# Altium schematic sheet DCDC_Slow.SchDoc
size 594 x 420 mm; Address1: Address1; Address2: Address2; Address3: Address3; Address4: Address4; SheetNumber: 1; Scale: 1:1; Разраб.: Иванов; Обозначение документа: АБВГ.123456.001 Э3; Пров.: Петров; Утв.: Сидоров; Наименование организации: ОАО "Концерн "МПО-Гидроприбор"; Перв. применение: АБВГ.123456.000; Наименование изделия 1: Плата; Наименование изделия 2: Схема электрическая; Наименование изделия 3: принципиальная; Нач. отд.: Нач. отд.; Фамилия нач. отд.: Сидоров
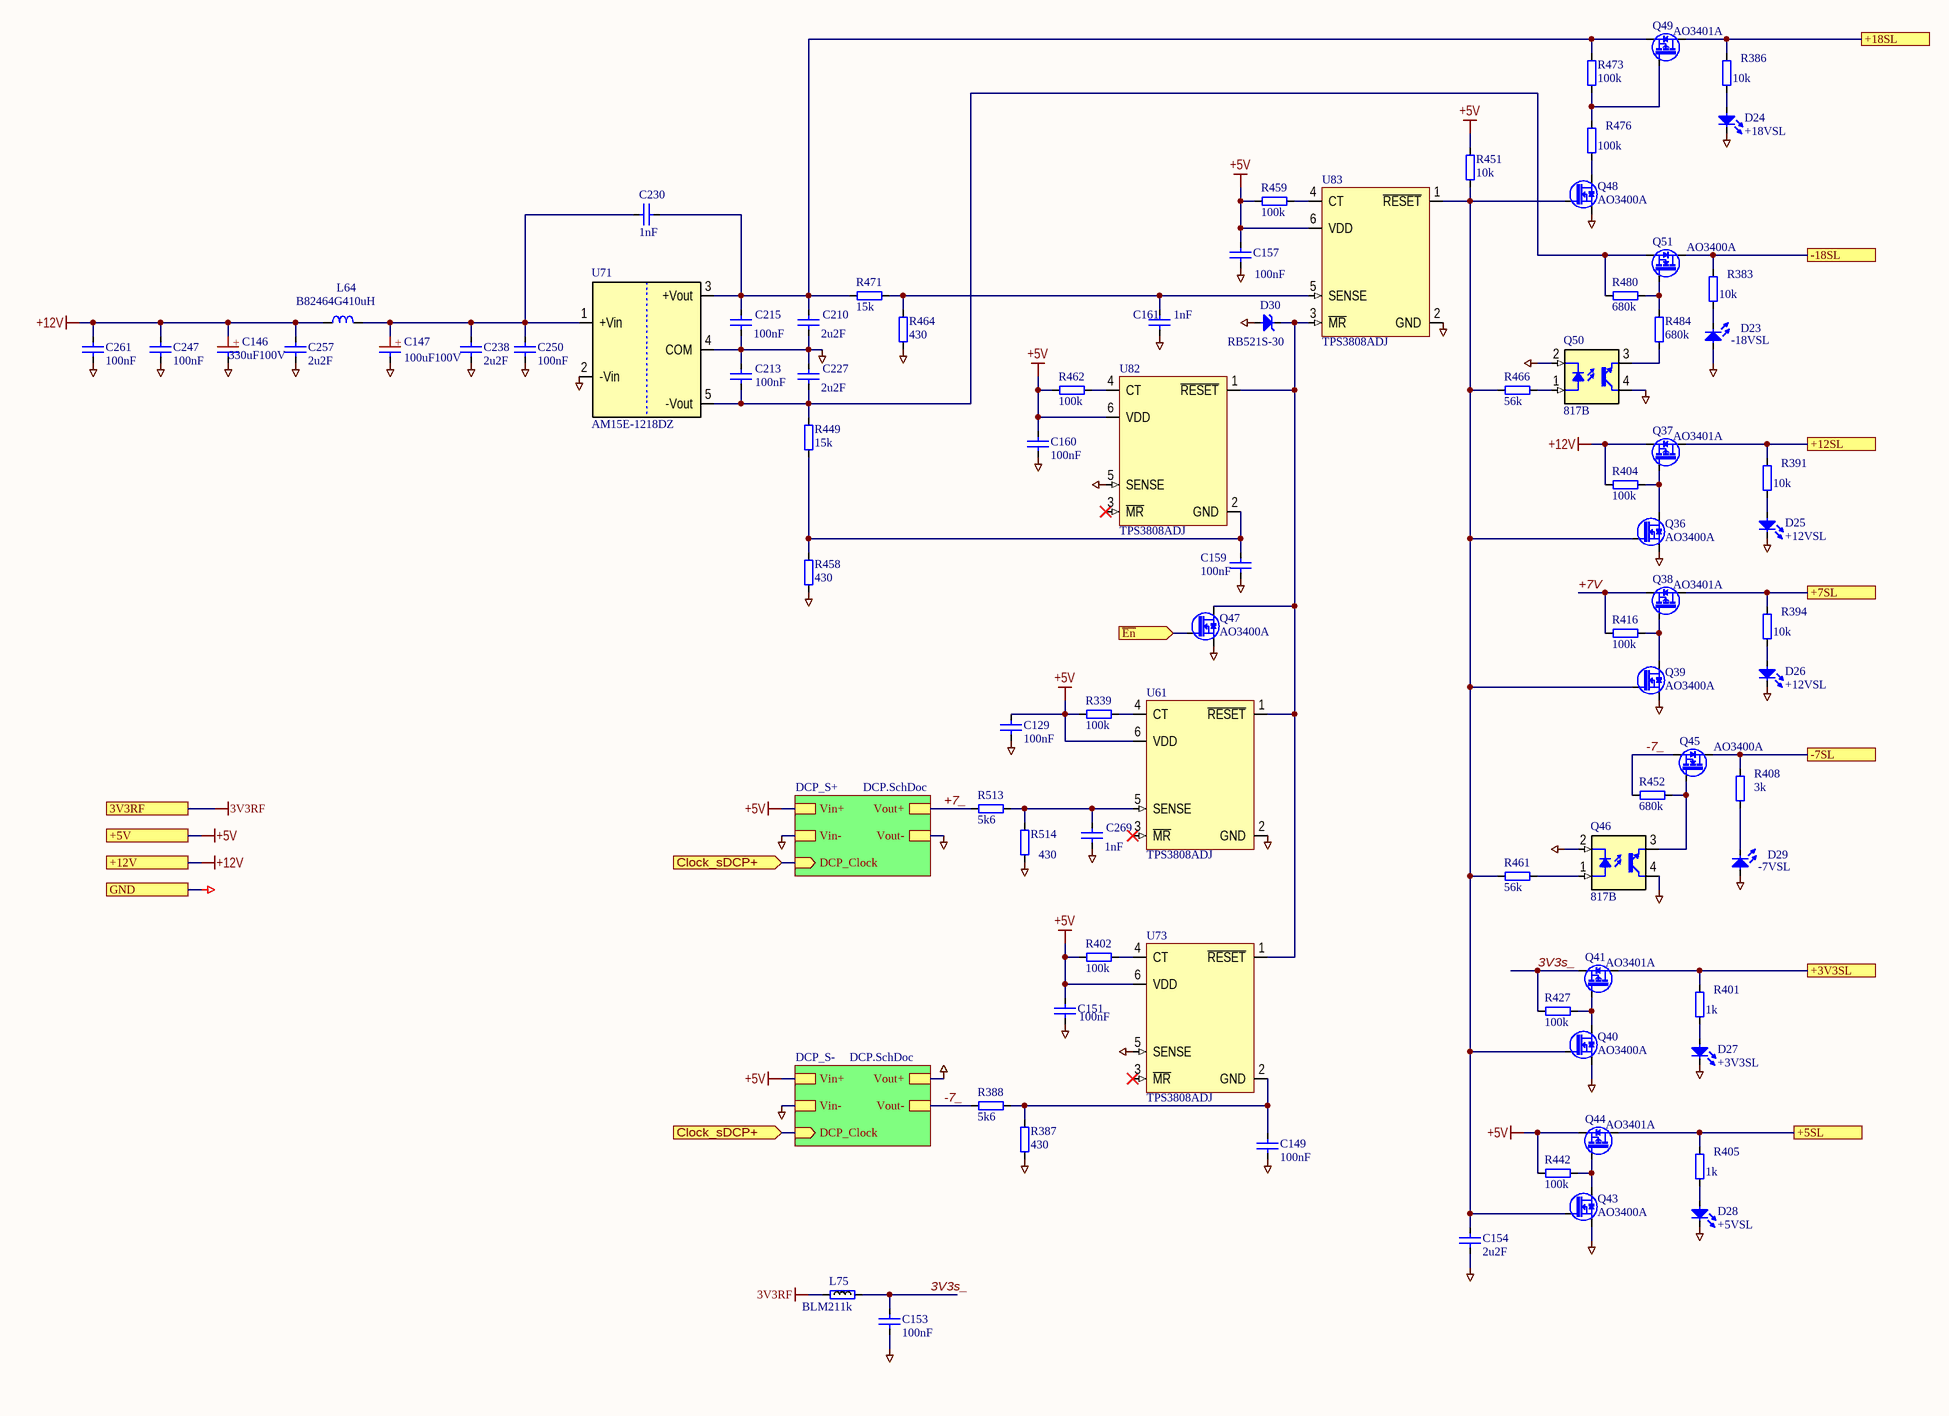
[diagram p0: DCDC_Slow.SchDoc]

## Parts
C129  100nF  [SMD0805CAP]
C146  330uF100V  [CAPPR750-1600X2000]
C147  100uF100V  [CAPPR500-1000X1250]
C149  100nF  [SMD0805CAP]
C151  100nF  [SMD0805CAP]
C153  100nF  [SMD0805CAP]
C154  2u2F  [SMD0805CAP]
C157  100nF  [SMD0805CAP]
C159  100nF  [SMD0805CAP]
C160  100nF  [SMD0805CAP]
C161  1nF  [SMD0805CAP]
C210  2u2F  [SMD0805CAP]
C213  100nF  [SMD0805CAP]
C215  100nF  [SMD0805CAP]
C227  2u2F  [SMD0805CAP]
C230  1nF  [SMD0805CAP]
C238  2u2F  [SMD0805CAP]
C247  100nF  [SMD0805CAP]
C250  100nF  [SMD0805CAP]
C257  2u2F  [SMD0805CAP]
C261  100nF  [SMD0805CAP]
C269  1nF  [SMD0805CAP]
D23  -18VSL  [LED0603]
D24  +18VSL  [LED0603]
D25  +12VSL  [LED0603]
D26  +12VSL  [LED0603]
D27  +3V3SL  [LED0603]
D28  +5VSL  [LED0603]
D29  -7VSL  [LED0603]
D30  RB521S-30  [SODFL1608X65N]
L64  B82464G410uH  [IND_COILCRAFT_MSS1038]
L75  BLM211k  [RESC2012X50N]
Q36  AO3400A  [SOT95P229X119-3N]
Q37  AO3401A  [SOT95P229X119-3N]
Q38  AO3401A  [SOT95P229X119-3N]
Q39  AO3400A  [SOT95P229X119-3N]
Q40  AO3400A  [SOT95P229X119-3N]
Q41  AO3401A  [SOT95P229X119-3N]
Q43  AO3400A  [SOT95P229X119-3N]
Q44  AO3401A  [SOT95P229X119-3N]
Q45  AO3400A  [SOT95P229X119-3N]
Q46  817B  [DIP4-300]
Q47  AO3400A  [SOT95P229X119-3N]
Q48  AO3400A  [SOT95P229X119-3N]
Q49  AO3401A  [SOT95P229X119-3N]
Q50  817B  [DIP4-300]
Q51  AO3400A  [SOT95P229X119-3N]
R339  100k  [SMD0805RES]
R383  10k  [SMD0805RES]
R386  10k  [SMD0805RES]
R387  430  [SMD0805RES]
R388  5k6  [SMD0805RES]
R391  10k  [SMD0805RES]
R394  10k  [SMD0805RES]
R401  1k  [SMD0805RES]
R402  100k  [SMD0805RES]
R404  100k  [SMD0805RES]
R405  1k  [SMD0805RES]
R408  3k  [SMD0805RES]
R416  100k  [SMD0805RES]
R427  100k  [SMD0805RES]
R442  100k  [SMD0805RES]
R449  15k  [SMD0805RES]
R451  10k  [SMD0805RES]
R452  680k  [SMD0805RES]
R458  430  [SMD0805RES]
R459  100k  [SMD0805RES]
R461  56k  [SMD0805RES]
R462  100k  [SMD0805RES]
R464  430  [SMD0805RES]
R466  56k  [SMD0805RES]
R471  15k  [SMD0805RES]
R473  100k  [SMD0805RES]
R476  100k  [SMD0805RES]
R480  680k  [SMD0805RES]
R484  680k  [SMD0805RES]
R513  5k6  [SMD0805RES]
R514  430  [SMD0805RES]
U61  TPS3808ADJ  [SOT95P270X145-6N]
U71  AM15E-1218DZ  [DCDC_Aimtec_Dual]
U73  TPS3808ADJ  [SOT95P270X145-6N]
U82  TPS3808ADJ  [SOT95P270X145-6N]
U83  TPS3808ADJ  [SOT95P270X145-6N]

## Sub-sheets
DCP_S+ = DCP.SchDoc: DCP_Clock (in), Vout+, Vout-, Vin-, Vin+
DCP_S- = DCP.SchDoc: DCP_Clock (in), Vout+, Vout-, Vin-, Vin+

## Ports
3V3RF, +3V3SL, +5SL, +5V, +7SL, +12SL, +12V, +18SL, -7SL, -18SL, Clock_sDCP+ (in), GND, ~{En} (in)

## Nets
3V3RF: L75.2 ; port 3V3RF
+5V: C129.2 C151.2 C157.2 C160.2 Q44.2(S) R339.1 R402.1 R442.2 R451.1 R459.1 R462.1 U61.6(VDD) U73.6(VDD) U82.6(VDD) U83.6(VDD) ; port +5V, sheet DCP_S+/Vin+, sheet DCP_S-/Vin+
+12V: C146.1(+) C247.2 C257.2 C261.2 L64.1 Q37.2(S) R404.2 ; port +12V
GND: C129.1 C146.2 C147.2 C149.2 C151.1 C153.1 C154.2 C157.1 C159.2 C160.1 C161.1 C210.1 C213.1 C215.2 C227.2 C238.1 C247.1 C250.2 C257.1 C261.1 C269.1 D23.2(A) D24.1(C) D25.1(C) D26.1(C) D27.1(C) D28.1(C) D29.2(A) D30.2(A) Q36.2(S) Q39.2(S) Q40.2(S) Q43.2(S) Q46.2(C) Q46.4(C) Q47.2(S) Q48.2(S) Q50.2(C) Q50.4(C) R387.1 R458.1 R464.1 R514.2 U61.2(GND) U71.2(-Vin) U71.4(COM) U73.5(SENSE) U82.5(SENSE) U83.2(GND) ; port GND, sheet DCP_S+/Vout-, sheet DCP_S+/Vin-, sheet DCP_S-/Vout+, sheet DCP_S-/Vin-
3V3s_: C153.2 L75.1 Q41.2(S) R427.2
+3V3SL: Q41.3(D) R401.2 ; port +3V3SL
+5SL: Q44.3(D) R405.2 ; port +5SL
+7_: R513.2 ; sheet DCP_S+/Vout+
+7SL: Q38.3(D) R394.2 ; port +7SL
+7V: Q38.2(S) R416.2
+12SL: Q37.3(D) R391.2 ; port +12SL
+18SL: Q49.3(D) R386.2 ; port +18SL
-7_: Q45.2(S) R388.1 R452.2 ; sheet DCP_S-/Vout-
-7SL: Q45.3(D) R408.2 ; port -7SL
-18SL: Q51.3(D) R383.2 ; port -18SL
~{En}: Q47.1(G) ; port ~{En}
Clock_sDCP+: port Clock_sDCP+, sheet DCP_S+/DCP_Clock, sheet DCP_S-/DCP_Clock
NetC147_1: C147.1(+) C230.1 C238.2 C250.1 L64.2 U71.1(+Vin)
NetC149_1: C149.1 R387.2 R388.2 U73.2(GND)
NetC154_1: C154.1 Q36.1(G) Q39.1(G) Q40.1(G) Q43.1(G) Q48.1(G) R451.2 R461.1 R466.1 U83.1(~{RESET})
NetC159_1: C159.1 R449.2 R458.2 U82.2(GND)
NetC161_2: C161.2 R464.2 R471.1 U83.5(SENSE)
NetC210_2: C210.2 C215.1 C230.2 Q49.2(S) R471.2 R473.1 U71.3(+Vout)
NetC213_2: C213.2 C227.1 Q51.2(S) R449.1 R480.2 U71.5(-Vout)
NetC269_2: C269.2 R513.1 R514.1 U61.5(SENSE)
NetD23_1: D23.1(C) R383.1
NetD24_2: D24.2(A) R386.1
NetD25_2: D25.2(A) R391.1
NetD26_2: D26.2(A) R394.1
NetD27_2: D27.2(A) R401.1
NetD28_2: D28.2(A) R405.1
NetD29_1: D29.1(C) R408.1
NetD30_1: D30.1(C) Q47.3(D) U61.1(~{RESET}) U73.1(~{RESET}) U82.1(~{RESET}) U83.3(~{MR})
NetQ36_3: Q36.3(D) Q37.1(G) R404.1
NetQ38_1: Q38.1(G) Q39.3(D) R416.1
NetQ40_3: Q40.3(D) Q41.1(G) R427.1
NetQ43_3: Q43.3(D) Q44.1(G) R442.1
NetQ45_1: Q45.1(G) Q46.3(E) R452.1
NetQ46_1: Q46.1(A) R461.2
NetQ48_3: Q48.3(D) R476.1
NetQ49_1: Q49.1(G) R473.2 R476.2
NetQ50_1: Q50.1(A) R466.2
NetQ50_3: Q50.3(E) R484.1
NetQ51_1: Q51.1(G) R480.1 R484.2
NetR339_2: R339.2 U61.4(CT)
NetR402_2: R402.2 U73.4(CT)
NetR459_2: R459.2 U83.4(CT)
NetR462_2: R462.2 U82.4(CT)

Not connected (* = marked no-connect by the designer): U61 3(~{MR})*; U73 3(~{MR})*; U82 3(~{MR})*

## Notes on the sheet
- Подп. и дата
- Инв. № дубл.
- Взам. инв. №
- Инв. № подл.
- Изм.
- Лист
- № докум.
- Подп.
- Дата
- Копировал
- Формат А2

## Library data of the parts
C129 C149 C151 C153 C154 C157 C159-C161 C210 C213 C215 C227 C230 C238 C247 C250 C257 C261 C269 = C0805: Чип конденсатор 0805; Voltage: 25V; Vendor: Vishay; DielectricType: X5R; SMD Solders: 2; Solder Option: RM; Tolerance: 20%; Pkg: SMD0805; Device: Cap0805; Price: 2
  C129 C149 C151 C153 C157 C159 C160 C213 C215 C247 C250 C261: Value: 100nF
  C154 C210 C227 C238 C257: Value: 2u2F
  C161 C230 C269: Value: 1nF
C146 = CAP_POL_7_5x16: Конденсатор полярный d16 p7.5мм; Voltage: 100V; Vendor: Vishay; Value: 330uF; SMD Solders: 0; Solder Option: RM; Tolerance: 20%; Pkg: 7.5x16mm; Device: Cap+; THD Solders: 2; Price: 30
C147 = CAP_POL_5x10: Конденсатор полярный d10 p5мм; Voltage: 100V; Vendor: Vishay; Value: 100uF; SMD Solders: 0; Solder Option: RM; Tolerance: 20%; Pkg: 5x10mm; Device: Cap+; THD Solders: 2; Price: 20
D23-D29 = LED0603: Чип светодиод 0603; Vendor: KB; SMD Solders: 2; Solder Option: RM; Pkg: SMD0603; Price: 10; Device: LED0603
  D23: Value: -18VSL
  D24: Value: +18VSL
  D25 D26: Value: +12VSL
  D27: Value: +3V3SL
  D28: Value: +5VSL
  D29: Value: -7VSL
D30 = RB521S-30: Чип Шоттки диод; Vendor: CTK; Voltage: 30V; SMD Solders: 2; Solder Option: RM; Pkg: SOD523; Price: 5; Device: RB521S-30; Name to order: RB521S-30
L64 = B82464G4: SMD Дроссель; Vendor: Epcos; Value: 10uH; Voltage: 2; Solder Option: RM; Tolerance: 20%; Pkg: SMD10.4x10.4mm; THD Solders: 0; Name to order: B82464G4103M; Current: 3A5; Price: 400; SMD Solders: 2; Device: B82464G4
L75 = BLM21: SMD Ferrite bead 0805; Vendor: Vishay; Value: 1k; Pkg: SMD0805; SMD Solders: 2; Solder Option: RM; Price: 10; Device: BLM21
Q36 Q39 Q40 Q43 Q45 Q47 Q48 Q51 = AO3400A: NMOS; Vendor: UMW; Pkg: SOT23; SMD Solders: 3; Solder Option: RM; Voltage: 30V; Price: 10; Device: AO3400A; Name to order: AO3400A
Q37 Q38 Q41 Q44 Q49 = AO3401A: PMOS; Vendor: UMW; Pkg: SOT23; SMD Solders: 3; Solder Option: RM; THD Solders: 0; Voltage: -30V; Price: 10; Device: AO3401A; Name to order: AO3401A
Q46 Q50 = 817B: Optotransistor; Pkg: DIP4; SMD Solders: 0; Solder Option: RM; THD Solders: 4; Vendor: UMW; Voltage: 35V; Device: 817B; Price: 10; Name to order: 817B; Current: 0
R339 R383 R386-R388 R391 R394 R401 R402 R404 R405 R408 R416 R427 R442 R449 R451 R452 R458 R459 R461 R462 R464 R466 R471 R473 R476 R480 R484 R513 R514 = R0805: Чип резистор 0805; Vendor: Vishay; SMD Solders: 2; Solder Option: RM; TC: 100ppm/C; Tolerance: 1%; Pkg: SMD0805; Pwr: 125mW; Device: Res0805; Price: 2
  R339 R402 R404 R416 R427 R442 R459 R462 R473 R476: Value: 100k
  R383 R386 R391 R394 R451: Value: 10k
  R387 R458 R464 R514: Value: 430
  R388 R513: Value: 5k6
  R401 R405: Value: 1k
  R408: Value: 3k
  R449 R471: Value: 15k
  R452 R480 R484: Value: 680k
  R461 R466: Value: 56k
U61 U73 U82 U83 = TPS3808: Supervisory Circuit. Low-Quiescent-Current, Programmable-Delay; Vendor: Texas Instruments; Value: ADJ; Pkg: SOT23-6; SMD Solders: 6; Solder Option: RM; THD Solders: 0; Name to order: TPS3808G01DBV; Current: 6uA; thVoltage: 400mV; Price: 200; Device: TPS3808
U71 = AM15E-: DC-DC+&-Halvoisolated out; Vendor: Aimtec; Value: 1218DZ; Pkg: DCDC_5; SMD Solders: 0; Solder Option: RM; THD Solders: 5; Name to order: AM15-1218DZ; Price: 2000; Device: AM15E-